# Altium project MB1389.PrjPcb (part 1 of 3)
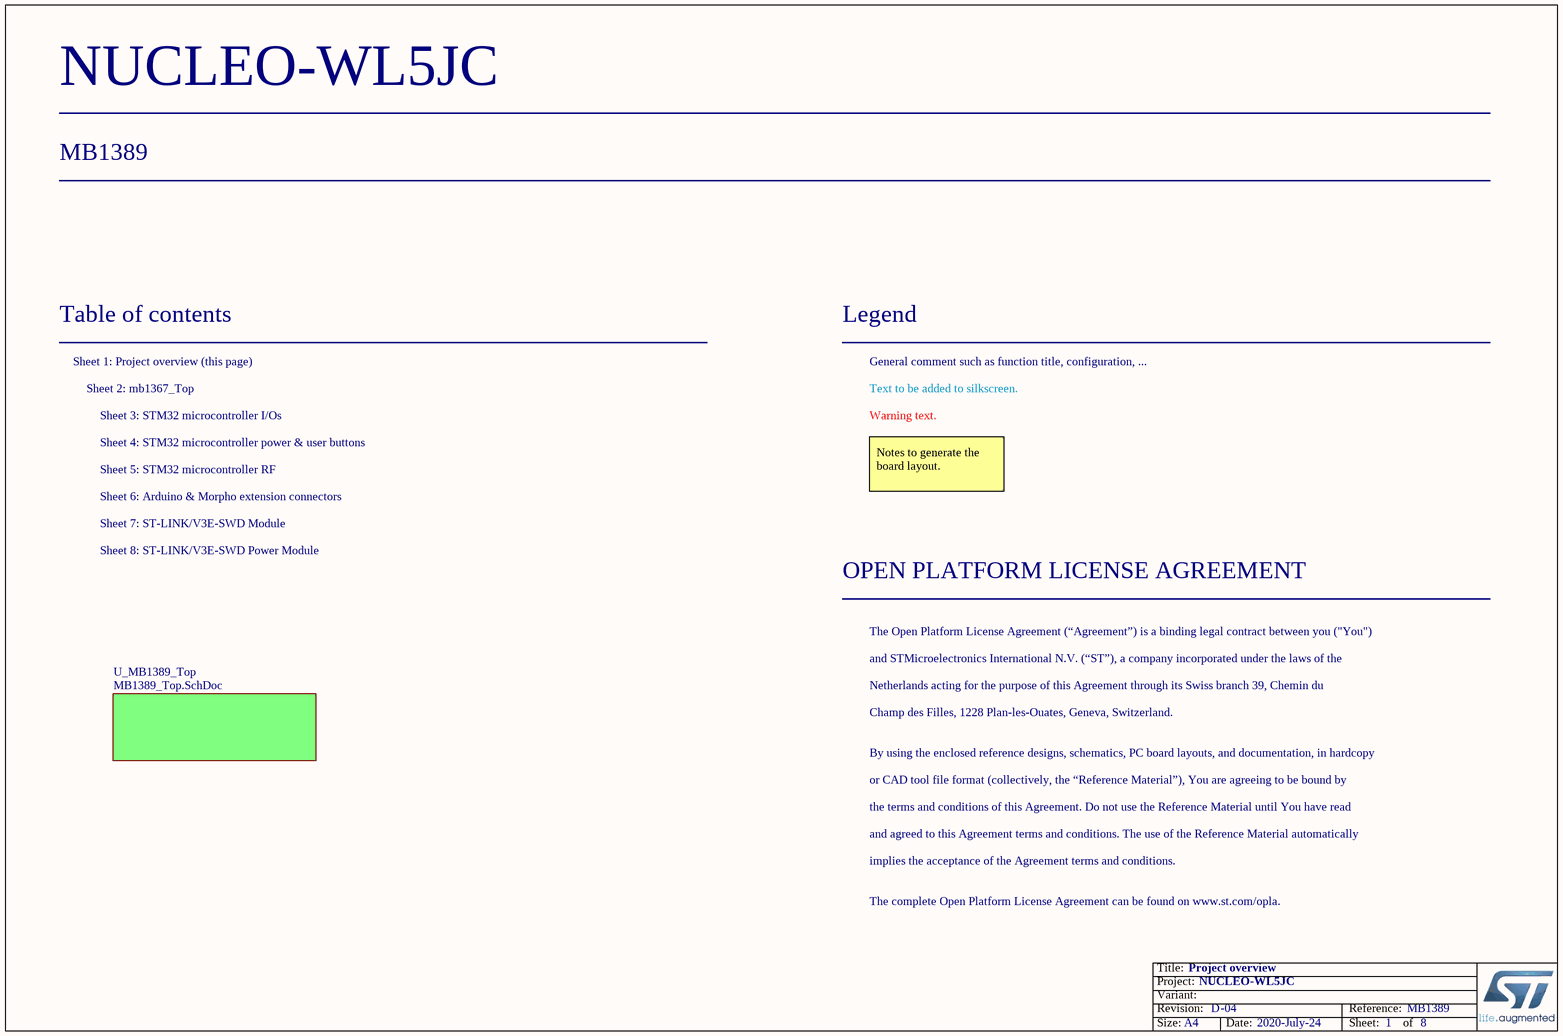
[diagram p0: Project_overview.SchDoc]
Board_Assembly_Revision: 04; Board_Document_Date: 2020-July-24; Board_Name: NUCLEO-WL5JC; Board_PCB_Revision: D; Board_Reference: MB1389
8 sheets, 259 parts. Net scope: flat (ports and power ports of the same name join across sheets).
Board file: MB1389.PcbDoc
Sheets:
  Project_overview.SchDoc
    U_MB1389_Top = MB1389_Top.SchDoc
      U_STM32_microcontroller_IOs = STM32_microcontroller_IOs.SchDoc
      U_STLink_V3E_Module = STLink_V3E_Module.SchDoc
      U_STLink_V3E_PWR = STLink_V3E_PWR.SchDoc
      U_Arduino_extension_connectors = Arduino_extension_connectors.SchDoc
      U_STM32_microcontroller_RF = STM32_microcontroller_RF.SchDoc
      U_STM32_microcontroller_power = STM32_microcontroller_power.SchDoc

## Sheet Project_overview.SchDoc: Project overview
size A4; Date: Not used; ApprovedBy: Not used; CheckedBy: Not used; Author: Not used; CompanyName: STMicroelectronics; DrawnBy: Not used; Engineer: Not used; Organization: Not used; Address1: Not used; Address2: Not used; Address3: Not used; Address4: Not used; DocumentNumber: 1; Revision: Not used; SheetNumber: 1; SheetTotal: 8; CurrentTime: Not used; CurrentDate: Not used; Time: Not used; DocumentFullPathAndName: Not used; DocumentName: Not used; ModifiedDate: Not used; ImagePath: Not used; ProjectName: Not used; Application_BuildNumber: Not used

### Sub-sheets
U_MB1389_Top = MB1389_Top.SchDoc: no entries

### Notes on the sheet
- Table of contents
- Sheet 1: Project overview (this page)
- Legend
- General comment such as function title, configuration, ...
- Sheet 2: mb1367_Top
- Sheet 4: STM32 microcontroller power & user buttons
- Sheet 3: STM32 microcontroller I/Os
- Text to be added to silkscreen.
- Warning text.
- Sheet 6: Arduino & Morpho extension connectors
- Sheet 5: STM32 microcontroller RF
- Notes to generate the board layout.
- Sheet 7: ST-LINK/V3E-SWD Module
- Sheet 8: ST-LINK/V3E-SWD Power Module
- OPEN PLATFORM LICENSE AGREEMENT
- The Open Platform License Agreement (“Agreement”) is a binding legal contract between you ("You")
- and STMicroelectronics International N.V. (“ST”), a company incorporated under the laws of the
- Netherlands acting for the purpose of this Agreement through its Swiss branch 39, Chemin du
- Champ des Filles, 1228 Plan-les-Ouates, Geneva, Switzerland.
- By using the enclosed reference designs, schematics, PC board layouts, and documentation, in hardcopy
- or CAD tool file format (collectively, the “Reference Material”), You are agreeing to be bound by
- the terms and conditions of this Agreement. Do not use the Reference Material until You have read
- and agreed to this Agreement terms and conditions. The use of the Reference Material automatically
- implies the acceptance of the Agreement terms and conditions.
- The complete Open Platform License Agreement can be found on www.st.com/opla.
- Title:
- Project:
- Size:
- Revision:
- Variant:
- A4
- -
- Date:
- Reference:
- Sheet:
- of

## Sheet MB1389_Top.SchDoc: Top hierarchical view
size A4; Date: Not used; ApprovedBy: Not used; CheckedBy: Not used; Author: Not used; CompanyName: STMicroelectronics; DrawnBy: Not used; Engineer: Not used; Organization: Not used; Address1: Not used; Address2: Not used; Address3: Not used; Address4: Not used; DocumentNumber: 2; Revision: Not used; SheetNumber: 2; SheetTotal: 8; CurrentTime: Not used; CurrentDate: Not used; Time: Not used; DocumentFullPathAndName: Not used; DocumentName: Not used; ModifiedDate: Not used; ImagePath: Not used; ProjectName: Not used; Application_BuildNumber: Not used
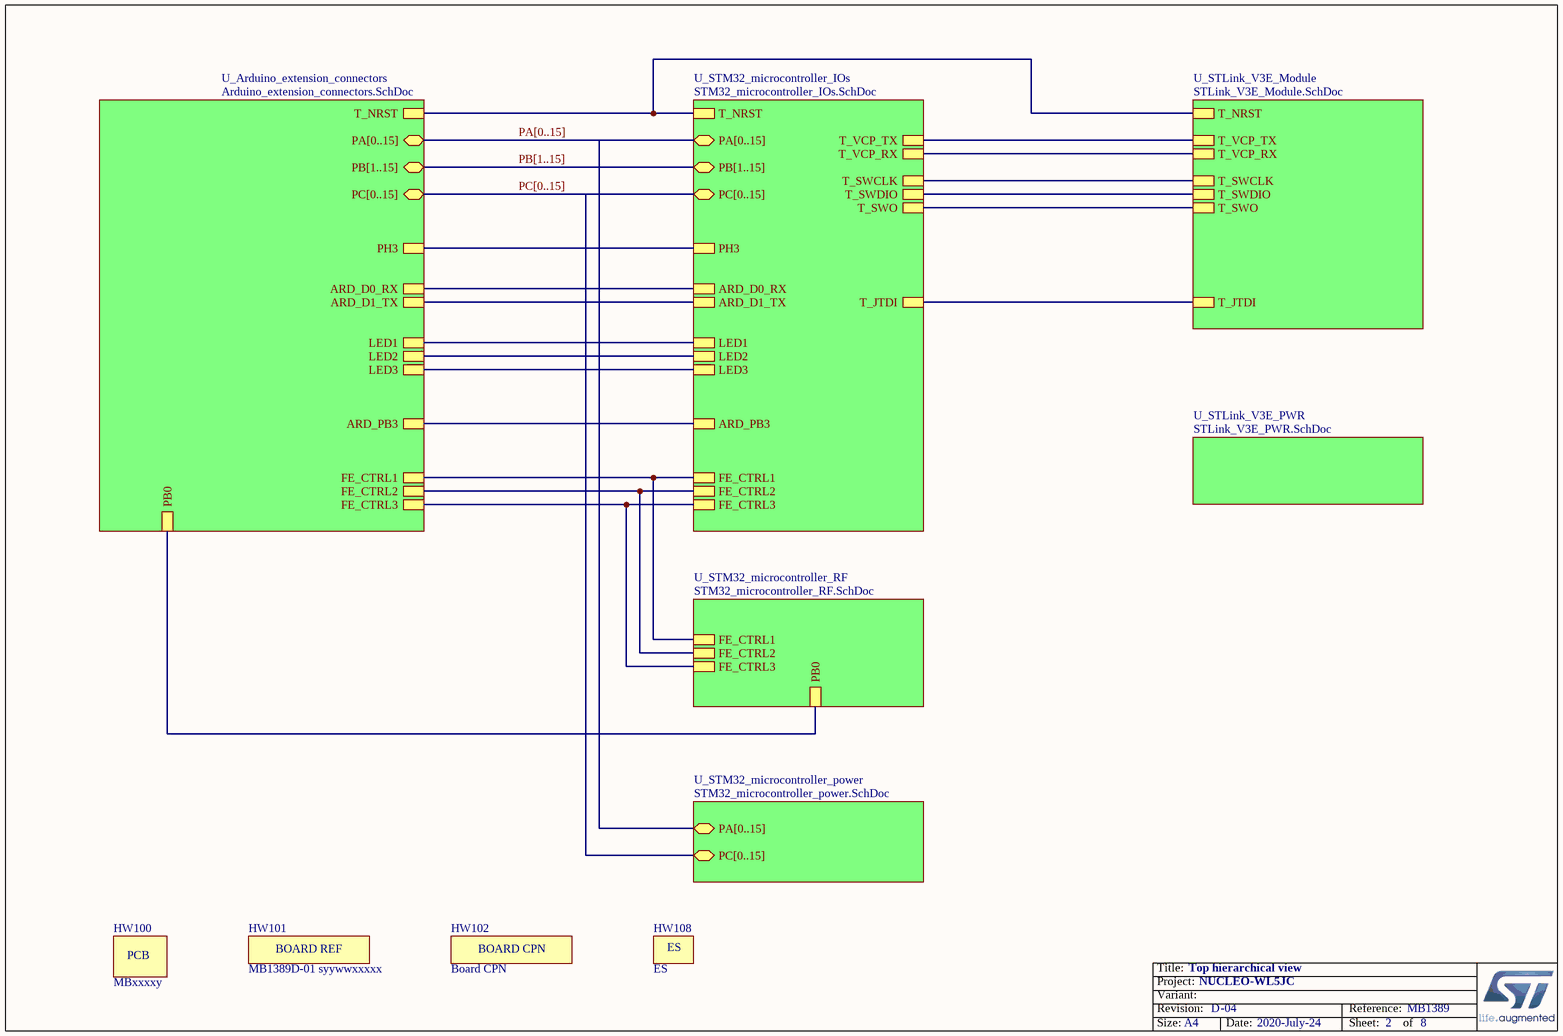
[diagram p1: MB1389_Top.SchDoc]

### Parts
HW100  value MBxxxxy  (mechanical)
HW101  value MB1389D-01 syywwxxxxx  [STICKER_BOARD-REF_25X5]  (mechanical)
HW102  value Board CPN  [STICKER_BOARD-CPN_25X5]  (mechanical)
HW108  value ES  (mechanical)

### Sub-sheets
U_Arduino_extension_connectors = Arduino_extension_connectors.SchDoc: PA[0..15] (bidir), PB[1..15] (bidir), PC[0..15] (bidir), T_NRST, ARD_D0_RX, ARD_D1_TX, LED1, LED2, LED3, FE_CTRL1, FE_CTRL2, PB0, PH3, FE_CTRL3, ARD_PB3
U_STLink_V3E_Module = STLink_V3E_Module.SchDoc: T_SWCLK, T_SWO, T_NRST, T_SWDIO, T_VCP_TX, T_VCP_RX, T_JTDI
U_STLink_V3E_PWR = STLink_V3E_PWR.SchDoc: no entries
U_STM32_microcontroller_IOs = STM32_microcontroller_IOs.SchDoc: T_NRST, PA[0..15] (bidir), PB[1..15] (bidir), PC[0..15] (bidir), ARD_D0_RX, ARD_D1_TX, T_VCP_TX, T_VCP_RX, T_SWCLK, T_SWO, T_SWDIO, T_JTDI, FE_CTRL2, FE_CTRL1, LED1, LED2, LED3, PH3, FE_CTRL3, ARD_PB3
U_STM32_microcontroller_power = STM32_microcontroller_power.SchDoc: PA[0..15] (bidir), PC[0..15] (bidir)
U_STM32_microcontroller_RF = STM32_microcontroller_RF.SchDoc: FE_CTRL2, FE_CTRL1, PB0, FE_CTRL3

### Nets
(unnamed): sheet U_STM32_microcontroller_IOs/T_NRST, sheet U_STLink_V3E_Module/T_NRST, sheet U_Arduino_extension_connectors/T_NRST
(unnamed): sheet U_STM32_microcontroller_IOs/ARD_D0_RX, sheet U_Arduino_extension_connectors/ARD_D0_RX
(unnamed): sheet U_STM32_microcontroller_IOs/ARD_D1_TX, sheet U_Arduino_extension_connectors/ARD_D1_TX
(unnamed): sheet U_STM32_microcontroller_IOs/T_VCP_TX, sheet U_STLink_V3E_Module/T_VCP_TX
(unnamed): sheet U_STM32_microcontroller_IOs/T_VCP_RX, sheet U_STLink_V3E_Module/T_VCP_RX
(unnamed): sheet U_STM32_microcontroller_IOs/T_SWCLK, sheet U_STLink_V3E_Module/T_SWCLK
(unnamed): sheet U_STM32_microcontroller_IOs/T_SWO, sheet U_STLink_V3E_Module/T_SWO
(unnamed): sheet U_STM32_microcontroller_IOs/T_SWDIO, sheet U_STLink_V3E_Module/T_SWDIO
(unnamed): sheet U_STM32_microcontroller_IOs/T_JTDI, sheet U_STLink_V3E_Module/T_JTDI
(unnamed): sheet U_STM32_microcontroller_IOs/FE_CTRL2, sheet U_Arduino_extension_connectors/FE_CTRL2, sheet U_STM32_microcontroller_RF/FE_CTRL2
(unnamed): sheet U_STM32_microcontroller_IOs/FE_CTRL1, sheet U_Arduino_extension_connectors/FE_CTRL1, sheet U_STM32_microcontroller_RF/FE_CTRL1
(unnamed): sheet U_STM32_microcontroller_IOs/LED1, sheet U_Arduino_extension_connectors/LED1
(unnamed): sheet U_STM32_microcontroller_IOs/LED2, sheet U_Arduino_extension_connectors/LED2
(unnamed): sheet U_STM32_microcontroller_IOs/LED3, sheet U_Arduino_extension_connectors/LED3
(unnamed): sheet U_STM32_microcontroller_IOs/PH3, sheet U_Arduino_extension_connectors/PH3
(unnamed): sheet U_STM32_microcontroller_IOs/FE_CTRL3, sheet U_Arduino_extension_connectors/FE_CTRL3, sheet U_STM32_microcontroller_RF/FE_CTRL3
(unnamed): sheet U_STM32_microcontroller_IOs/ARD_PB3, sheet U_Arduino_extension_connectors/ARD_PB3
(unnamed): sheet U_Arduino_extension_connectors/PB0, sheet U_STM32_microcontroller_RF/PB0

### Buses and harness runs
bus PA[0..15] = sheet U_Arduino_extension_connectors/PA[0..15] = sheet U_STM32_microcontroller_IOs/PA[0..15] = sheet U_STM32_microcontroller_power/PA[0..15]
bus PB[1..15] = sheet U_Arduino_extension_connectors/PB[1..15] = sheet U_STM32_microcontroller_IOs/PB[1..15]
bus PC[0..15] = sheet U_Arduino_extension_connectors/PC[0..15] = sheet U_STM32_microcontroller_IOs/PC[0..15] = sheet U_STM32_microcontroller_power/PC[0..15]

### Notes on the sheet
- Title:
- Project:
- Size:
- Revision:
- Variant:
- A4
- -
- Date:
- Reference:
- Sheet:
- of
- (in symbol MCD-00235) BOARD REF
- (in symbol MCD-00547) BOARD CPN

### Library data of the parts
HW100 = MCD-00216: PCB, xxxx for PCB number, Y for PCB revision; Part_Type: Mechanical; Provided_By: SUBCO; Internal_Part_Number: MCD-00216; Status: Released; Manufacturer_Part_Number: n/a; Manufacturer: n/a; ComponentLink1Description: Datasheet; ECCN_US: n/a; ECCN_EU: n/a
HW101 = MCD-00235: Board sticker to mention board reference + serial number + QR code; Part_Type: Mechanical; Provided_By: SUBCO; Initial_Board_Reference: MB1319; Internal_Part_Number: MCD-00235; Status: Released; Manufacturer_Part_Number: n/a; Manufacturer: n/a; ComponentLink1Description: Datasheet; ComponentLink1URL: n/a
HW102 = MCD-00547: Product sticker to mention product CPN + product FG; Part_Type: Mechanical; Provided_By: SUBCO; Initial_Board_Reference: MB1319; Remark: PCH W35 footprint requested to have a space on board for stickers.; Internal_Part_Number: MCD-00547; Status: Released; Manufacturer_Part_Number: n/a; Manufacturer: n/a; ComponentLink1Description: Datasheet; ComponentLink1URL: NA
HW108 = MCD-00234: Sticker to mention ES sample; Part_Type: Mechanical; Provided_By: SUBCO; Initial_Board_Reference: MB1319; Internal_Part_Number: MCD-00234; Status: Released; Manufacturer_Part_Number: n/a; Manufacturer: n/a; ComponentLink1Description: Datasheet

## Sheet STM32_microcontroller_IOs.SchDoc: STM32 microcontroller I/Os
size A4; Date: Not used; ApprovedBy: Not used; CheckedBy: Not used; Author: Not used; CompanyName: STMicroelectronics; DrawnBy: Not used; Engineer: Not used; Organization: Not used; Address1: Not used; Address2: Not used; Address3: Not used; Address4: Not used; DocumentNumber: 3; Revision: Not used; SheetNumber: 3; SheetTotal: 8; CurrentTime: Not used; CurrentDate: Not used; Time: Not used; DocumentFullPathAndName: Not used; DocumentName: Not used; ModifiedDate: Not used; ImagePath: Not used; ProjectName: Not used; Application_BuildNumber: Not used
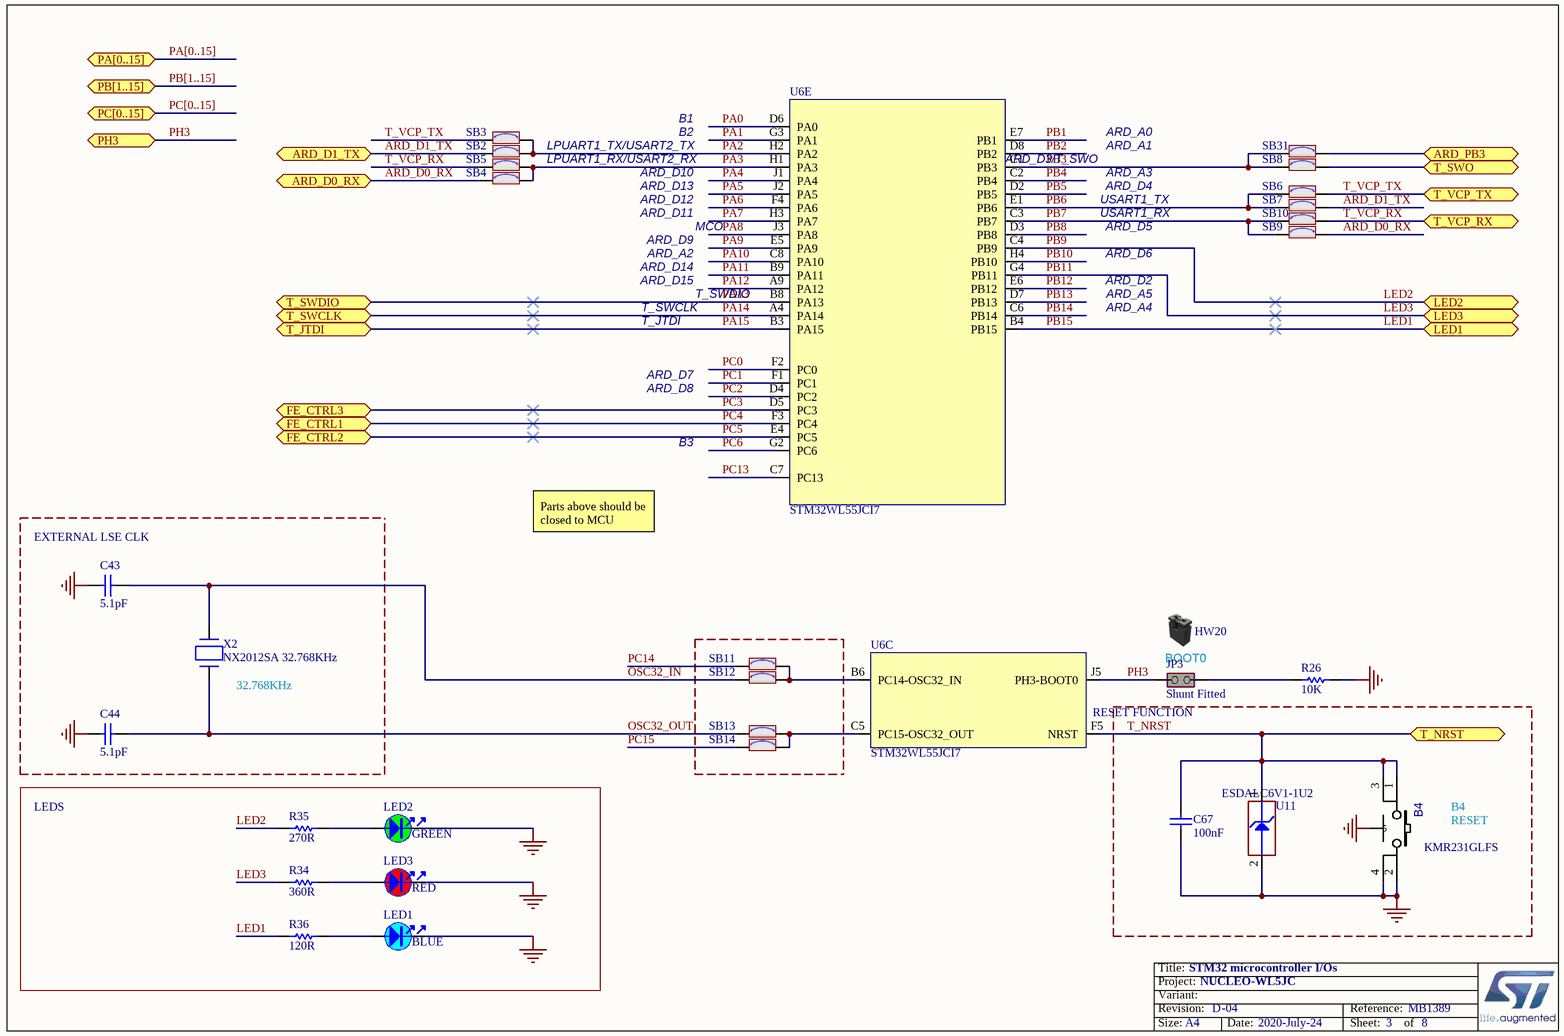
[diagram p2: STM32_microcontroller_IOs.SchDoc]

### Parts
B4  value KMR231GLFS  [SWI_C&K_Y78B23110FP__ITT_KMR231GLFS]
C43  value 5.1pF  [C0402]
C44  value 5.1pF  [C0402]
C67  value 100nF  [C0402]
HW20  (no value)  (mechanical)
JP3  value Shunt Fitted  [CON_SAMTEC_TSW-102-07-G-S]
LED1  value BLUE  [LED_0603_OSRAM_LB-Q39G-L2OO-35-1_BLUE_1A2K_H0P4]
LED2  value GREEN  [LED_0603_OSRAM_LG-Q396-PS-35_GREEN_1A2K_H0P4]
LED3  value RED  [LED_0603_VISHAY_VLMS1300-GS08_RED_1A2K_H0P8]
R26  value 10K  [R0603]
R34  value 360R  [R0402]
R35  value 270R  [R0402]
R36  value 120R  [R0402]
SB2  (no value)  [SOLDER-BRIDGE_R0603-0R]
SB3  (no value)  [SOLDER-BRIDGE_R0603-0R]
SB4  (no value)  [SOLDER-BRIDGE_R0603-0R]
SB5  (no value)  [SOLDER-BRIDGE_R0603-0R]
SB6  (no value)  [SOLDER-BRIDGE_R0603-0R]
SB7  (no value)  [SOLDER-BRIDGE_R0603-0R]
SB8  (no value)  [SOLDER-BRIDGE_R0603-0R]
SB9  (no value)  [SOLDER-BRIDGE_R0603-0R]
SB10  (no value)  [SOLDER-BRIDGE_R0603-0R]
SB11  (no value)  [SOLDER-BRIDGE_R0603-0R]
SB12  (no value)  [SOLDER-BRIDGE_R0603-0R]
SB13  (no value)  [SOLDER-BRIDGE_R0603-0R]
SB14  (no value)  [SOLDER-BRIDGE_R0603-0R]
SB31  (no value)  [SOLDER-BRIDGE_R0603-0R]
U6  value STM32WL55JCI7  [ICC_UFBGA73_5X5_P050]  (parts C,E of 5)
U11  value ESDALC6V1-1U2  [ESD_ST0201]
X2  value NX2012SA 32.768KHz  [CRY_NX2012SA_2P]

### Blocks framed on the sheet
LEDS: LED1-LED3 R34-R36

### Ports
ARD_D0_RX, ARD_D1_TX, ARD_PB3, FE_CTRL1, FE_CTRL2, FE_CTRL3, LED1, LED2, LED3, PA[0..15] (bidir), PB[1..15] (bidir), PC[0..15] (bidir), PH3, T_JTDI, T_NRST, T_SWCLK, T_SWDIO, T_SWO, T_VCP_RX, T_VCP_TX

### Nets
GND: B4.2 B4.4 B4.5 C43.2 C44.2 C67.1 LED1.2 LED2.2 LED3.2 R26.1 U11.2(GND)
ARD_D0_RX: SB4.2 SB9.1 ; port ARD_D0_RX
ARD_D1_TX: SB2.2 SB7.1 ; port ARD_D1_TX
ARD_PB3: SB31.2 ; port ARD_PB3
LED1: R36.1 U6.B4(PB15) ; port LED1  [also labelled PB15]
LED2: R35.1 U6.C4(PB9) ; port LED2  [also labelled PB9]
LED3: R34.1 U6.G4(PB11) ; port LED3  [also labelled PB11]
OSC32_IN: C43.1 SB12.1 X2.2(X2)
OSC32_OUT: C44.1 SB13.1 X2.1(X1)
PA0: U6.D6(PA0)
PA1: U6.G3(PA1)
PA2: SB2.1 SB3.2 U6.H2(PA2)
PA3: SB4.1 SB5.2 U6.H1(PA3)
PA4: U6.J1(PA4)
PA5: U6.J2(PA5)
PA6: U6.F4(PA6)
PA7: U6.H3(PA7)
PA8: U6.J3(PA8)
PA9: U6.E5(PA9)
PA10: U6.C8(PA10)
PA11: U6.B9(PA11)
PA12: U6.A9(PA12)
PA13: U6.B8(PA13) ; port T_SWDIO
PA14: U6.A4(PA14) ; port T_SWCLK
PA15: U6.B3(PA15) ; port T_JTDI
PB1: U6.E7(PB1)
PB2: U6.D8(PB2)
PB3: SB8.1 SB31.1 U6.C1(PB3)
PB4: U6.C2(PB4)
PB5: U6.D2(PB5)
PB6: SB6.1 SB7.2 U6.E1(PB6)
PB7: SB9.2 SB10.1 U6.C3(PB7)
PB8: U6.D3(PB8)
PB10: U6.H4(PB10)
PB12: U6.E6(PB12)
PB13: U6.D7(PB13)
PB14: U6.C6(PB14)
PC0: U6.F2(PC0)
PC1: U6.F1(PC1)
PC2: U6.D4(PC2)
PC3: U6.D5(PC3) ; port FE_CTRL3  [project net FE_CTRL3]
PC4: U6.F3(PC4) ; port FE_CTRL1  [project net FE_CTRL1]
PC5: U6.E4(PC5) ; port FE_CTRL2  [project net FE_CTRL2]
PC6: U6.G2(PC6)
PC13: U6.C7(PC13)
PC14: SB11.1
PC15: SB14.1
PH3: JP3.1(COMMON) U6.J5(PH3-BOOT0) ; port PH3
T_NRST: B4.1 B4.3 C67.2 U6.F5(NRST) U11.1(IO1) ; port T_NRST
T_SWO: SB8.2 ; port T_SWO
T_VCP_RX: SB5.1 SB10.2 ; port T_VCP_RX
T_VCP_TX: SB3.1 SB6.2 ; port T_VCP_TX
NetJP3_2: JP3.2(NO) R26.2
NetLED1_1: LED1.1 R36.2
NetLED2_1: LED2.1 R35.2
NetLED3_1: LED3.1 R34.2
NetSB11_2: SB11.2 SB12.2 U6.B6(PC14-OSC32_IN)
NetSB13_2: SB13.2 SB14.2 U6.C5(PC15-OSC32_OUT)

### Buses and harness runs
bus PA[0..15] = port PA[0..15]
bus PB[1..15] = port PB[1..15]
bus PC[0..15] = port PC[0..15]

### Notes on the sheet
- LPUART1_TX/USART2_TX
- LPUART1_RX/USART2_RX
- ARD_D10
- B2
- B1
- ARD_D3/T_SWO
- ARD_A0
- ARD_A1
- ARD_A3
- ARD_D13
- ARD_D12
- ARD_D11
- ARD_D9
- MCO
- USART1_RX
- USART1_TX
- ARD_D5
- ARD_D4
- T_SWCLK
- T_SWDIO
- ARD_D14
- ARD_D15
- ARD_A2
- ARD_D6
- ARD_A4
- ARD_A5
- ARD_D2
- T_JTDI
- ARD_D7
- ARD_D8
- B3
- (near C43) EXTERNAL LSE CLK
- Parts above should be closed to MCU
- (near X2) 32.768KHz
- RESET FUNCTION
- (near JP3) BOOT0
- RESET
- B4
- Title:
- Project:
- Size:
- Revision:
- Variant:
- A4
- -
- Date:
- Reference:
- Sheet:
- of

### Library data of the parts
B4 = MCD-01485: Microminiature Tact Switch for SMT - KMR 2 Series - 1.9 mm height; Part_Type: Misc; Manufacturer: C&K; Provided_By: SUBCO; Internal_Part_Number: MCD-01485; Status: Checked; Manufacturer_Part_Number: KMR231GLFS; ComponentLink1Description: Datasheet; ComponentLink1URL: http://tunmcdsvn.tun.st.com/Component_Datasheet_Library/Trunk/Misc/C&K_tactile_switch_KMR_series; ECCN_US: n/a; ECCN_EU: n/a
C43 C44 = MCD-00003: Capacitor, MLCC, 5.1pF, 50V, NPO, +-0.25pF, 0402, T=0.5mm; Manufacturer_Part_Number: CC0402CRNPO9BN5R1; Manufacturer: YAGEO; Provided_By: SUBCO; ECCN_US: EAR99; ECCN_EU: NEC; Internal_Part_Number: MCD-00003; Status: Released; Part_Type: Capacitor; Package: C0402; ComponentLink1Description: Datasheet; ComponentLink1URL: http://tunmcdsvn.tun.st.com/Component_Datasheet_Library/Trunk/Capacitors/Yageo_Capacitor_NP0_16V-to-50V
C67 = MCD-00102: Capacitor, MLCC, 100nF, 16V, X7R, 10%, 0402, T=0,5mm; Manufacturer_Part_Number: CC0402KRX7R7BB104; Manufacturer: YAGEO; Alternate_Manufacturer_Part_Number: GCM155R71C104KA55D; Alternate_Manufacturer: MURATA; Provided_By: SUBCO; ECCN_US: EAR99; ECCN_EU: NEC; Internal_Part_Number: MCD-00102; Status: Released; Package: C0402; ComponentLink1Description: Datasheet; Part_Type: Capacitor; ComponentLink1URL: http://tunmcdsvn.tun.st.com/Component_Datasheet_Library/Trunk/Capacitors/Yageo_Multilayer_Capacitor_X7R_series_100pF_to_22uF
HW20 = MCD-00043: SHUNT 2.54mm BLACK; Manufacturer_Part_Number: SNT-100-BK-G; Manufacturer: SAMTEC; Part_Type: Mechanical; Alternate_Manufacturer_Part_Number: 316102S111A; Alternate_Manufacturer: JIUBABA; Provided_By: SUBCO; Value: SNT-100-BK-G; Internal_Part_Number: MCD-00043; ComponentLink1Description: Datasheet; Status: Released; ComponentLink1URL: http://tunmcdsvn.tun.st.com/Component_Datasheet_Library/Trunk/Connectors/Samtec_Shunt_Jumper_SNT100; ECCN_US: n/a; ECCN_EU: n/a
JP3 = MCD-00683: Header, 2x1, 2,54mm, VR, TH, Height 5.84mm/2.54mm - Shunt Fitted by default; Part_Type: Connector; Manufacturer_Part_Number: TSW-102-07-x-S; Manufacturer: SAMTEC; Alternate_Manufacturer_Part_Number: 313102S111116; Alternate_Manufacturer: LIANYI; Provided_By: SUBCO; Internal_Part_Number: MCD-00683; Status: Released; ComponentLink1Description: Datasheet; ComponentLink1URL: http://tunmcdsvn.tun.st.com/Component_Datasheet_Library/Trunk/Connectors/Samtec_TSW-HTSW-series; ECCN_US: n/a; ECCN_EU: n/a
LED1 = MCD-00585: LED Blue, 0603 SMD, Forward Voltage Min=2,8V, Max=3,8V; Part_Type: Display; Manufacturer_Part_Number: LB Q39G-L2OO-35-1; Manufacturer: OSRAM OPTO SEMICONDUCTORS; Alternate_Manufacturer_Part_Number: 19-217-BHC-ZL1M2RY-3T-V4; Alternate_Manufacturer: EVERLIGHT; Order_Code_RS: 9148643; Provided_By: SUBCO; Internal_Part_Number: MCD-00585; Status: Released; Package: LED 0603; ComponentLink1Description: Datasheet; ComponentLink1URL: http://tunmcdsvn.tun.st.com/Component_Datasheet_Library/Trunk/Display/OSRAM_LED_BLUE_LB Q39G-L2OO-35-1; Order_Code_Digikey: 475-2816-1-ND; ECCN_US: n/a; ECCN_EU: n/a
LED2 = MCD-00588: LED Green, 0603 SMD, Forward Voltage Typ=2V, Max=2.5V; Part_Type: Display; Manufacturer_Part_Number: LG Q396-PS-35; Manufacturer: OSRAM OPTO SEMICONDUCTORS; Alternate_Manufacturer_Part_Number: VLMTG1300-GS08; Alternate_Manufacturer: VISHAY SEMICONDUCTOR OPTO DIVISION; Provided_By: SUBCO; Internal_Part_Number: MCD-00588; Status: Released; Package: LED 0603; ComponentLink1Description: Datasheet; ComponentLink1URL: http://tunmcdsvn.tun.st.com/Component_Datasheet_Library/Trunk/Display/OSRAM_LED_GREEN_LG Q396-PS-35; Order_Code_Digikey: LG Q396-PS-35-ND; ECCN_US: n/a; ECCN_EU: n/a
LED3 = MCD-00587: LED Red, 0603 SMD, 2V Forward Voltage; Part_Type: Display; Manufacturer_Part_Number: VLMS1300-GS08; Manufacturer: VISHAY; Alternate_Manufacturer_Part_Number: LS Q976-NR-1; Alternate_Manufacturer: OSRAM OPTO SEMICONDUCTORS; Provided_By: SUBCO; Internal_Part_Number: MCD-00587; Status: Released; Package: LED 0603; ComponentLink1Description: Datasheet; ComponentLink1URL: http://tunmcdsvn.tun.st.com/Component_Datasheet_Library/Trunk/Display/VISHAY_LED_RED_VLMS1300-GS08; Order_Code_Digikey: VLMS1300-GS08CT-ND; Order_Code_Farnell: 2078728; ECCN_US: n/a; ECCN_EU: n/a
R26 = MCD-00220: Resistor,10K,0603,1%,1/10W; Manufacturer_Part_Number: RC0603FR-0710KL; Manufacturer: YAGEO; Provided_By: SUBCO; ECCN_US: EAR99; ECCN_EU: NEC; Internal_Part_Number: MCD-00220; ComponentLink1Description: Datasheet; Status: Released; Part_Type: Resistor; Package: R0603; ComponentLink1URL: http://tunmcdsvn.tun.st.com/Component_Datasheet_Library/Trunk/Resistors/Yageo_Resistor_RC0603-series
R34 = MCD-00461: Resistor,360R,0402,1%,1/16W; Manufacturer_Part_Number: RC0402FR-07360RL; Manufacturer: YAGEO; Provided_By: SUBCO; ECCN_US: EAR99; ECCN_EU: NEC; Internal_Part_Number: MCD-00461; Status: Released; Part_Type: Resistor; Package: R0402; ComponentLink1Description: Datasheet; ComponentLink1URL: http://tunmcdsvn.tun.st.com/Component_Datasheet_Library/Trunk/Resistors/Yageo_Resistor_RC0402-series
R35 = MCD-00441: Resistor,270R,0402,1%,1/16W; Manufacturer_Part_Number: RC0402FR-07270RL; Manufacturer: YAGEO; Provided_By: SUBCO; ECCN_US: EAR99; ECCN_EU: NEC; Internal_Part_Number: MCD-00441; Status: Released; Part_Type: Resistor; Package: R0402; ComponentLink1Description: Datasheet; ComponentLink1URL: http://tunmcdsvn.tun.st.com/Component_Datasheet_Library/Trunk/Resistors/Yageo_Resistor_RC0402-series
R36 = MCD-00194: Resistor,120R,0402,1%,1/16W; Manufacturer_Part_Number: RC0402FR-07120RL; Manufacturer: YAGEO; Provided_By: SUBCO; ECCN_US: EAR99; ECCN_EU: NEC; Internal_Part_Number: MCD-00194; Status: Released; Part_Type: Resistor; Package: R0402; ComponentLink1Description: Datasheet; ComponentLink1URL: http://tunmcdsvn.tun.st.com/Component_Datasheet_Library/Trunk/Resistors/Yageo_Resistor_RC0402-series
SB2-SB14 SB31 = MCD-00071: Solder Bridge ON; Part_Type: Mechanical; Manufacturer_Part_Number: RC0603JR-070RL; Manufacturer: YAGEO; Provided_By: SUBCO; Internal_Part_Number: MCD-00071; Status: Released; Package: SB0603; ComponentLink1Description: Datasheet; ComponentLink1URL: http://tunmcdsvn.tun.st.com/Component_Datasheet_Library/Trunk/Resistors/Yageo_Resistor_RC0603-series; ECCN_US: n/a; ECCN_EU: n/a
U6 = MCD-01435: Multiprotocol Wireless 32-bit MCUwith LPWAN Sub-GHz radio solution; Part_Type: IC; Manufacturer: STMICROELECTRONICS; ECCN_US: tbd; Internal_Part_Number: MCD-01435; Status: Footprint available; Manufacturer_Part_Number: STM32WL55JCI7; Package: UFBGA73; ComponentLink1Description: Datasheet; ComponentLink1URL: http://tunmcdsvn.tun.st.com/Component_Datasheet_Library/Trunk/IC/STM_STM32WL5x; Provided_By: n/a; ECCN_EU: tbd
U11 = MCD-00170: ESD protection 6V1; Part_Type: Diode; Manufacturer: STMICROELECTRONICS; BMS_Part_Number: 9151132; Provided_By: SUBCO with ST control; ECCN_US: EAR99; ECCN_EU: NEC; Internal_Part_Number: MCD-00170; Status: Released; Manufacturer_Part_Number: ESDALC6V1-1U2; ComponentLink1Description: Datasheet; ComponentLink1URL: http://tunmcdsvn.tun.st.com/Component_Datasheet_Library/Trunk/Diodes/STM_ESD_ESDALC6V1-1U2
X2 = MCD-01479: Crystal 32.768kHz, 6pF, -+20ppm, 80Kohm max, SMD; Part_Type: Crystal_Osc; Manufacturer_Part_Number: NX2012SA 32.768KHz EXS00A-MU00527; Manufacturer: NDK; BMS_Part_Number: 9157049; Provided_By: SUBCO; ECCN_US: EAR99; ECCN_EU: NEC; Internal_Part_Number: MCD-01479; Status: Checked; Package: NX2012SA; ComponentLink1Description: Datasheet; ComponentLink1URL: http://tunmcdsvn.tun.st.com/Component_Datasheet_Library/Trunk/Crystal_Osc/NDK_NX2012SA 32.768KHz EXS00A-MU00527; Order_Code_Digikey: 644-1352

## Sheet STLink_V3E_Module.SchDoc: ST-LINK/V3E-SWD Module
size A4; Date: Not used; ApprovedBy: Not used; CheckedBy: Not used; Author: Alphonse BRUNO; CompanyName: STMicroelectronics; DrawnBy: Not used; Engineer: Not used; Organization: Not used; Address1: Not used; Address2: Not used; Address3: Not used; Address4: Not used; DocumentNumber: Not used; Revision: Not used; SheetNumber: 7; SheetTotal: 8; CurrentTime: Not used; CurrentDate: Not used; Time: Not used; DocumentFullPathAndName: Not used; DocumentName: Not used; ModifiedDate: Not used; ImagePath: Not used; ProjectName: Not used; Application_BuildNumber: Not used
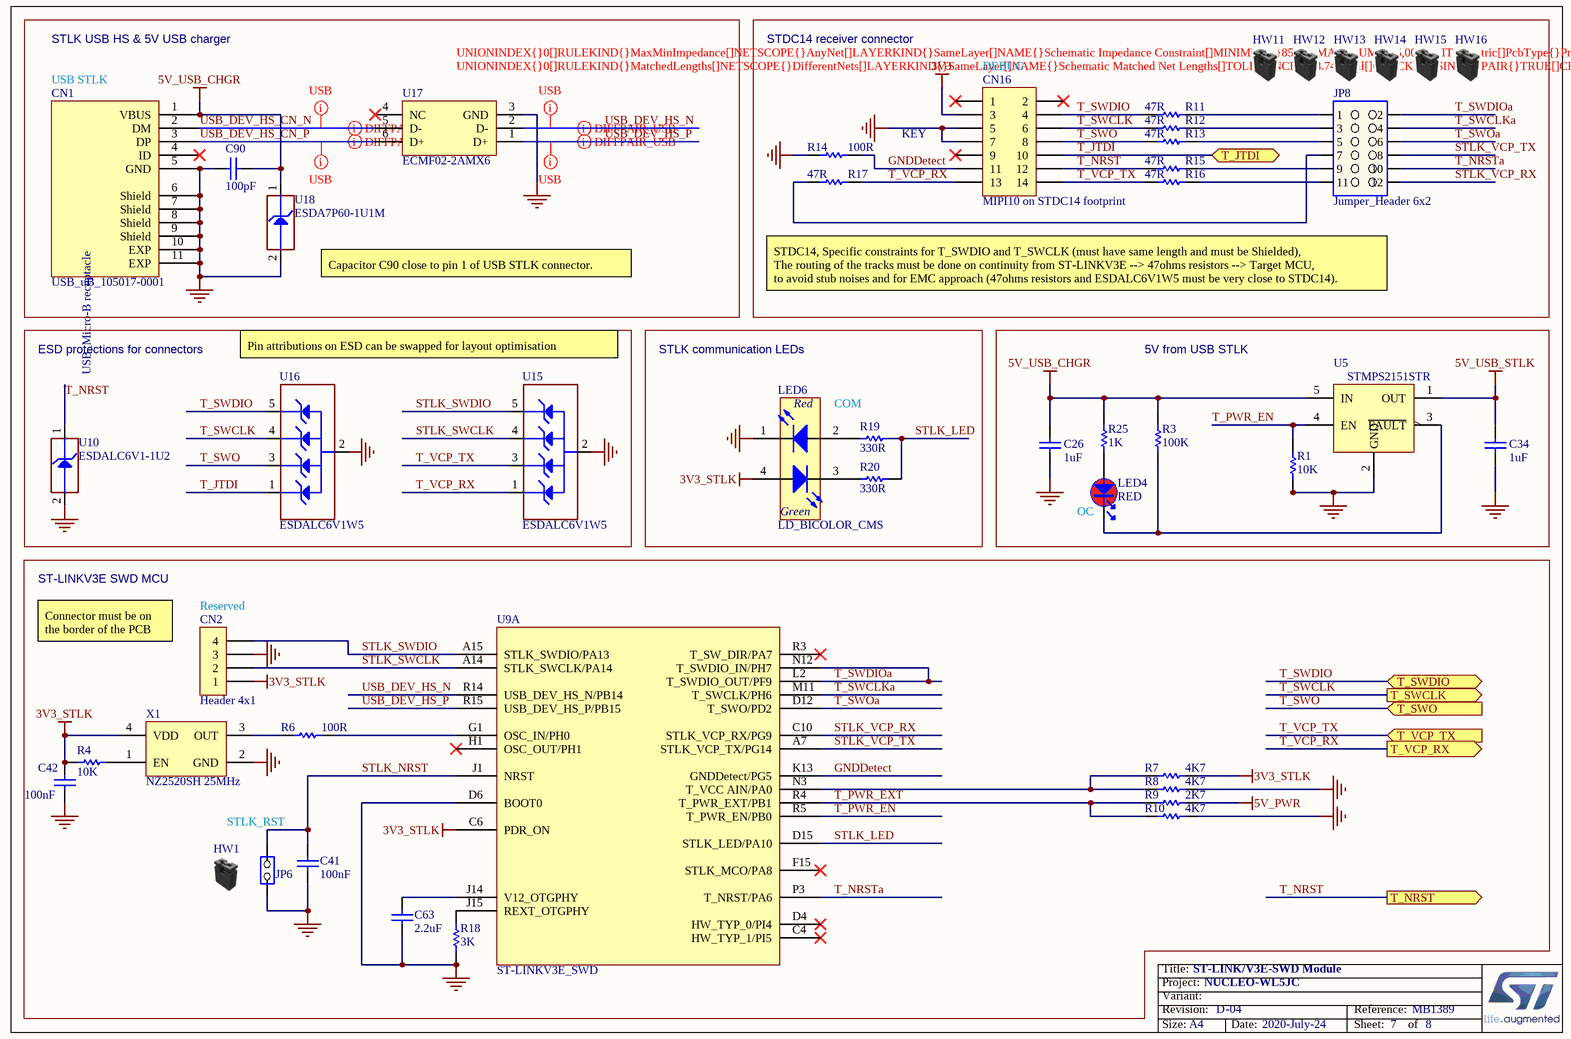
[diagram p3: STLink_V3E_Module.SchDoc]

### Parts
C26  value 1uF  [C0603]
C34  value 1uF  [C0603]
C41  value 100nF  [C0402]
C42  value 100nF  [C0402]
C63  value 2.2uF  [C0603]
C90  value 100pF  [C0402]
CN1  value USB_uB_105017-0001  [CON_USBMICROB_MOLEX_105017-0001_H2P90]
CN2  value Header 4x1  [CON_SAMTEC_TSW-104-07-G-S]
CN16  value MIPI10 on STDC14 footprint  [CON_STDC14_Receiver_MEDIUM_WITH_MIPI10_3D]
HW1  (no value)  (mechanical)
HW11  (no value)  (mechanical)
HW12  (no value)  (mechanical)
HW13  (no value)  (mechanical)
HW14  (no value)  (mechanical)
HW15  (no value)  (mechanical)
HW16  (no value)  (mechanical)
JP6  (no value)  [CON_SAMTEC_TSW-102-07-G-S]
JP8  value Jumper_Header 6x2  [CON_SAMTEC_TSW-106-07-X-D]
LED4  value RED  [LED_0603_VISHAY_VLMS1300-GS08_RED_1A2K_H0P8]
LED6  value LD_BICOLOR_CMS  [LED_BI-GR_HSMF-A201-A00J1]
R1  value 10K  [R0402]
R3  value 100K  [R0402]
R4  value 10K  [R0402]
R6  value 100R  [R0402]
R7  value 4K7  [R0402]
R8  value 4K7  [R0402]
R9  value 2K7  [R0402]
R10  value 4K7  [R0402]
R11  value 47R  [R0402]
R12  value 47R  [R0402]
R13  value 47R  [R0402]
R14  value 100R  [R0402]
R15  value 47R  [R0402]
R16  value 47R  [R0402]
R17  value 47R  [R0402]
R18  value 3K  [R0402]
R19  value 330R  [R0603]
R20  value 330R  [R0603]
R25  value 1K  [R0603]
U5  value STMPS2151STR  [MOS_SOT23-5L]
U9  value ST-LINKV3E_SWD  [ICC_UFBGA201_176+25_10X10_P065]  (part A of 2)
U10  value ESDALC6V1-1U2  [ESD_ST0201]
U15  value ESDALC6V1W5  [ESD_SOT323-5L]
U16  value ESDALC6V1W5  [ESD_SOT323-5L]
U17  value ECMF02-2AMX6  [ESD_QFN-6L_1P7X1P5_P050]
U18  value ESDA7P60-1U1M  [ESD_QFN2_1P6X1_P125]
X1  value NZ2520SH 25MHz  [OSC_NDK_NZ2520SB_4P]

### Blocks framed on the sheet
ESD protections for connectors: U10 U15 U16

### Ports
T_JTDI, T_NRST, T_SWCLK, T_SWDIO, T_SWO, T_VCP_RX, T_VCP_TX

### Nets
3V3: CN16.3
3V3_STLK: C42.2 CN2.1 LED6.4(YellowGreen_anode) R4.1 R7.1 U9.C6(PDR_ON) X1.4(VDD)
5V_PWR: R9.1
5V_USB_CHGR: C26.2 C90.2 CN1.1(VBUS) R3.2 R25.2 U5.5(IN) U18.1(IO1)
5V_USB_STLK: C34.2 U5.1(OUT)
GND: C26.1 C34.1 C41.1 C42.1 C63.1 C90.1 CN1.5(GND) CN1.6(Shield) CN1.7(Shield) CN1.8(Shield) CN1.9(Shield) CN1.10(EXP) CN1.11(EXP) CN2.3 CN16.5 CN16.7 JP6.1(COMMON) LED6.1(RED_cathode) R1.1 R8.1 R10.1 R14.1 R18.1 U5.2(GND) U9.D6(BOOT0) U10.2(GND) U15.2(GND) U16.2(GND) U17.3(GND) U18.2(GND) X1.2(GND)
GNDDetect: CN16.11 R14.2 U9.K13(GNDDetect/PG5)
STLK_LED: R19.2 R20.2 U9.D15(STLK_LED/PA10)
STLK_NRST: C41.2 JP6.2(NO) U9.J1(NRST)
STLK_SWCLK: CN2.2 U9.A14(STLK_SWCLK/PA14) U15.4(IO3)
STLK_SWDIO: CN2.4 U9.A15(STLK_SWDIO/PA13) U15.5(IO4)
STLK_VCP_RX: JP8.12 U9.C10(STLK_VCP_RX/PG9)
STLK_VCP_TX: JP8.8 U9.A7(STLK_VCP_TX/PG14)
T_JTDI: CN16.10 U16.1(IO1) ; port T_JTDI  [project net PA15]
T_NRST: CN16.12 R15.1 U10.1(IO1) ; port T_NRST
T_NRSTa: JP8.10 U9.P3(T_NRST/PA6)
T_PWR_EN: R1.2 U5.4(EN) U9.R5(T_PWR_EN/PB0)
T_PWR_EXT: R9.2 R10.2 U9.R4(T_PWR_EXT/PB1)
T_SWCLK: CN16.6 R12.1 U16.4(IO3) ; port T_SWCLK  [project net PA14]
T_SWCLKa: JP8.4 U9.M11(T_SWCLK/PH6)
T_SWDIO: CN16.4 R11.1 U16.5(IO4) ; port T_SWDIO  [project net PA13]
T_SWDIOa: JP8.2 U9.L2(T_SWDIO_OUT/PF9) U9.N12(T_SWDIO_IN/PH7)
T_SWO: CN16.8 R13.1 U16.3(IO2) ; port T_SWO
T_SWOa: JP8.6 U9.D12(T_SWO/PD2)
T_VCP_RX: CN16.13 R17.2 U15.1(IO1) ; port T_VCP_RX
T_VCP_TX: CN16.14 R16.1 U15.3(IO2) ; port T_VCP_TX
USB_DEV_HS_CN_N: CN1.2(DM) U17.5(D-)
USB_DEV_HS_CN_P: CN1.3(DP) U17.6(D+)
USB_DEV_HS_N: U9.R14(USB_DEV_HS_N/PB14) U17.2(D-)
USB_DEV_HS_P: U9.R15(USB_DEV_HS_P/PB15) U17.1(D+)
NetC63_2: C63.2 U9.J14(V12_OTGPHY)
NetJP8_1: JP8.1 R11.2
NetJP8_3: JP8.3 R12.2
NetJP8_5: JP8.5 R13.2
NetJP8_7: JP8.7 R17.1
NetJP8_9: JP8.9 R15.2
NetJP8_11: JP8.11 R16.2
NetLED4_1: LED4.1 R25.1
NetLED4_2: LED4.2 R3.1 U5.3(~{FAULT})
NetLED6_2: LED6.2(Red_anode) R19.1
NetLED6_3: LED6.3(YellowGreen_cathode) R20.1
NetR4_2: R4.2 X1.1(EN)
NetR6_1: R6.1 X1.3(OUT)
NetR6_2: R6.2 U9.G1(OSC_IN/PH0)
NetR7_2: R7.2 R8.2 U9.N3(T_VCC_AIN/PA0)
NetR18_2: R18.2 U9.J15(REXT_OTGPHY)

Not connected (* = marked no-connect by the designer): CN1 4(ID)*; CN16 1* 2* 9*; U9 C4(HW_TYP_1/PI5)* D4(HW_TYP_0/PI4)* F15(STLK_MCO/PA8)* H1(OSC_OUT/PH1)* R3(T_SW_DIR/PA7)*; U17 4(NC)*

### Layout directives
differential pair; rule Impedance Constraint [Min = 85.00    Max = 95.00    ]: USB_DEV_HS_CN_N, USB_DEV_HS_CN_P, USB_DEV_HS_N, USB_DEV_HS_P
rule Undefined; rule Matched Net Lengths [Tolerance = 2mm]; rule Impedance Constraint [Min = 85.00    Max = 95.00    ]: USB_DEV_HS_CN_N, USB_DEV_HS_CN_P, USB_DEV_HS_N, USB_DEV_HS_P

### Notes on the sheet
- STLK USB HS & 5V USB charger
- STDC14 receiver connector
- USB STLK
- (near CN16) DEBUG
- KEY
- (near U18) Capacitor C90 close to pin 1 of USB STLK connector.
- STDC14, Specific constraints for T_SWDIO and T_SWCLK (must have same length and must be Shielded),
  The routing of the tracks must be done on continuity from ST-LINKV3E --> 47ohms resistors --> Target MCU,
  to avoid stub noises and for EMC approach (47ohms resistors and ESDALC6V1W5 must be very close to STDC14).
- Pin attributions on ESD can be swapped for layout optimisation
- STLK communication LEDs
- 5V from USB STLK
- COM
- (near LED4) OC
- ST-LINKV3E SWD MCU
- Connector must be on the border of the PCB
- (near CN2) Reserved
- STLK_RST
- Title:
- Project:
- Size:
- Revision:
- Variant:
- A4
- -
- Date:
- Reference:
- Sheet:
- of
- (in symbol MCD-00028) USB_Micro-B receptacle
- (in symbol MCD-00051) Red; Green

### Library data of the parts
C26 C34 = MCD-00010: Capacitor, MLCC, 1uF, 16V, X5R, 10%, 0603, T=0,8mm; Manufacturer_Part_Number: CC0603KRX5R7BB105; Manufacturer: YAGEO; Provided_By: SUBCO; ECCN_US: EAR99; ECCN_EU: NEC; Internal_Part_Number: MCD-00010; Status: Released; Package: C0603; ComponentLink1Description: Datasheet; Part_Type: Capacitor; ComponentLink1URL: http://tunmcdsvn.tun.st.com/Component_Datasheet_Library/Trunk/Capacitors/Yageo_Multilayer_capacitor_X5R_series_100pF_to_100uF
C41 C42 = MCD-00102: as C67 on sheet STM32_microcontroller_IOs; Internal_Part_Number: MCD-00102; Status: Released; Package: C0402; ComponentLink1Description: Datasheet; Part_Type: Capacitor; ComponentLink1URL: http://tunmcdsvn.tun.st.com/Component_Datasheet_Library/Trunk/Capacitors/Yageo_Multilayer_Capacitor_X7R_series_100pF_to_22uF
C63 = MCD-00012: Capacitor, MLCC, 2.2uF, 10V, X5R, 10%, 0603, T=0,8mm; Manufacturer_Part_Number: CC0603KRX5R6BB225; Manufacturer: YAGEO; Alternate_Manufacturer_Part_Number: C0603C225K8PACTU; Alternate_Manufacturer: KEMET; BMS_Part_Number: 9142010; Provided_By: SUBCO; ECCN_US: EAR99; ECCN_EU: NEC; Internal_Part_Number: MCD-00012; Status: Released; Package: C0603; ComponentLink1Description: Datasheet; Part_Type: Capacitor; ComponentLink1URL: http://tunmcdsvn.tun.st.com/Component_Datasheet_Library/Trunk/Capacitors/Yageo_Multilayer_capacitor_X5R_series_100pF_to_100uF
C90 = MCD-00205: Capacitor, MLCC, 100pF, 50V, NPO, 5%, 0402, T=0,5mm; Manufacturer_Part_Number: CC0402JRNPO9BN101; Manufacturer: YAGEO; Provided_By: SUBCO; ECCN_US: EAR99; ECCN_EU: NEC; Internal_Part_Number: MCD-00205; Status: Released; Part_Type: Capacitor; Package: C0402; ComponentLink1Description: Datasheet; ComponentLink1URL: http://tunmcdsvn.tun.st.com/Component_Datasheet_Library/Trunk/Capacitors/Yageo_Capacitor_NP0_16V-to-50V
CN1 = MCD-00028: USB-MICRO-B, 0.65mm, RA, SMT, Bottom Mount,; Manufacturer_Part_Number: 1050170001; Manufacturer: MOLEX; Part_Type: Connector; Provided_By: SUBCO; Internal_Part_Number: MCD-00028; Status: Released; ComponentLink1Description: Datasheet; ComponentLink1URL: http://tunmcdsvn.tun.st.com/Component_Datasheet_Library/Trunk/Connectors/Molex_Connector-USB-microB_105017-0001; ECCN_US: n/a; ECCN_EU: n/a
CN2 = MCD-00029: Header, 4x1, 2,54mm, VR, TH, Height 5.84mm/2.54mm; Part_Type: Connector; Manufacturer_Part_Number: TSW-104-07-x-S; Manufacturer: SAMTEC; Provided_By: SUBCO; Internal_Part_Number: MCD-00029; Status: Released; ComponentLink1Description: Datasheet; ComponentLink1URL: http://tunmcdsvn.tun.st.com/Component_Datasheet_Library/Trunk/Connectors/Samtec_TSW-HTSW-series; ECCN_US: n/a; ECCN_EU: n/a
CN16 = MCD-01226: Header 5x2, 1.27mm, Dual row, Straight, Surface mount, vertical male connector. 3.05mm lead. Mates with FFSD connector. Footprint compatible with FTSH-107-01-L-DV,-K,-A,-P,-ES (STDC14 MEDIUM); Manufacturer_Part_Number: FTSH-105-01-L-DV-K; Manufacturer: SAMTEC; Alternate_Manufacturer_Part_Number: P127B-2x05MGF-079-0A; Alternate_Manufacturer: JIUBABA; Provided_By: SUBCO; Internal_Part_Number: MCD-01226; Status: Released; Part_Type: Connector; ComponentLink1Description: Datasheet; ComponentLink1URL: http://tunmcdsvn.tun.st.com/Component_Datasheet_Library/Trunk/Connectors/Samtec_FTSH_smt_series; ECCN_US: n/a; ECCN_EU: n/a
HW1 = MCD-00043: as HW20 on sheet STM32_microcontroller_IOs; Internal_Part_Number: MCD-00043; ComponentLink1Description: Datasheet; Status: Released; ComponentLink1URL: http://tunmcdsvn.tun.st.com/Component_Datasheet_Library/Trunk/Connectors/Samtec_Shunt_Jumper_SNT100; ECCN_US: n/a; ECCN_EU: n/a
HW11-HW16 = MCD-00043: SHUNT 2.54mm BLACK; Part_Type: Mechanical; Manufacturer: SAMTEC; Alternate_Manufacturer_Part_Number: 316102S111A; Alternate_Manufacturer: JIUBABA; Value: SNT-100-BK-G; Provided_By: SUBCO; Internal_Part_Number: MCD-00043; Status: Released; Manufacturer_Part_Number: SNT-100-BK-G; ComponentLink1Description: Datasheet; ComponentLink1URL: http://tunmcdsvn.tun.st.com/Component_Datasheet_Library/Trunk/Connectors/Samtec_Shunt_Jumper_SNT100; ECCN_US: n/a; ECCN_EU: n/a
JP6 = MCD-00045: Header, 2x1, 2,54mm, VR, TH, Height 5.84mm/2.54mm; Manufacturer_Part_Number: TSW-102-07-G-S; Manufacturer: SAMTEC; Part_Type: Connector; Alternate_Manufacturer_Part_Number: 313102S111116;313102S111116; Alternate_Manufacturer: JIUBABA; LIANYI; Value: Shunt not fitted; Provided_By: SUBCO; Internal_Part_Number: MCD-00045; Status: Released; ComponentLink1Description: Datasheet; ComponentLink1URL: http://tunmcdsvn.tun.st.com/Component_Datasheet_Library/Trunk/Connectors/Samtec_TSW-HTSW-series; ECCN_US: n/a; ECCN_EU: n/a
JP8 = MCD-00692: Header, 6x2, 2,54mm, VR, TH, Height 5.84mm/2.54mm; Part_Type: Connector; Manufacturer_Part_Number: TSW-106-07-x-D; Manufacturer: SAMTEC; Provided_By: SUBCO; Internal_Part_Number: MCD-00692; Status: Checked; ComponentLink1Description: Datasheet; ComponentLink1URL: http://tunmcdsvn.tun.st.com/Component_Datasheet_Library/Trunk/Connectors/Samtec_TSW-HTSW-series; ECCN_US: n/a; ECCN_EU: n/a
LED4 = MCD-00587: as LED3 on sheet STM32_microcontroller_IOs; Internal_Part_Number: MCD-00587; Status: Released; Package: LED 0603; ComponentLink1Description: Datasheet; ComponentLink1URL: http://tunmcdsvn.tun.st.com/Component_Datasheet_Library/Trunk/Display/VISHAY_LED_RED_VLMS1300-GS08; Order_Code_Digikey: VLMS1300-GS08CT-ND; Order_Code_Farnell: 2078728; ECCN_US: n/a; ECCN_EU: n/a
LED6 = MCD-00051: LED Bicolor; Part_Type: Display; Manufacturer_Part_Number: HSMF-A201-A00J1; Manufacturer: AVAGO TECHNOLOGIES; Alternate_Manufacturer_Part_Number: LE-RGW35280; Alternate_Manufacturer: EVERLUCK; Provided_By: SUBCO; ECCN_US: EAR99; ECCN_EU: NEC; Internal_Part_Number: MCD-00051; Status: Released; ComponentLink1Description: Datasheet; ComponentLink1URL: http://tunmcdsvn.tun.st.com/Component_Datasheet_Library/Trunk/Display/Avago_LED-SMC_HSMx-A2xx-02Feb2012
R1 R4 = MCD-00053: Resistor,10K,0402,1%,1/16W; Manufacturer_Part_Number: RC0402FR-0710KL; Manufacturer: YAGEO; BMS_Part_Number: 9131590; Provided_By: SUBCO; ECCN_US: EAR99; ECCN_EU: NEC; Internal_Part_Number: MCD-00053; Status: Released; Part_Type: Resistor; Package: R0402; ComponentLink1Description: Datasheet; ComponentLink1URL: http://tunmcdsvn.tun.st.com/Component_Datasheet_Library/Trunk/Resistors/Yageo_Resistor_RC0402-series
R3 = MCD-00059: Resistor,100K,0402,1%,1/16W; Manufacturer_Part_Number: RC0402FR-07100KL; Manufacturer: YAGEO; Alternate_Manufacturer_Part_Number: RT0402FRE07100KL; Provided_By: SUBCO; ECCN_US: EAR99; ECCN_EU: NEC; Internal_Part_Number: MCD-00059; Status: Released; Part_Type: Resistor; Alternate_Manufacturer: YAGEO; Package: R0402; ComponentLink1Description: Datasheet; ComponentLink1URL: http://tunmcdsvn.tun.st.com/Component_Datasheet_Library/Trunk/Resistors/Yageo_Resistor_RC0402-series
R6 R14 = MCD-00119: Resistor,100R,0402,1%,1/16W; Manufacturer_Part_Number: RC0402FR-07100RL; Manufacturer: YAGEO; Provided_By: SUBCO; ECCN_US: EAR99; ECCN_EU: NEC; Internal_Part_Number: MCD-00119; Status: Released; Part_Type: Resistor; ComponentLink1Description: Datasheet; Package: R0402; ComponentLink1URL: http://tunmcdsvn.tun.st.com/Component_Datasheet_Library/Trunk/Resistors/Yageo_Resistor_RC0402-series
R7 R8 R10 = MCD-00065: Resistor,4K7,0402,1%,1/16W; Manufacturer_Part_Number: RC0402FR-074K7L; Manufacturer: YAGEO; Alternate_Manufacturer_Part_Number: RT0402FRE074K7L; Provided_By: SUBCO; ECCN_US: EAR99; ECCN_EU: NEC; Internal_Part_Number: MCD-00065; Status: Released; ComponentLink1Description: Datasheet; Alternate_Manufacturer: YAGEO; Part_Type: Resistor; Package: R0402; ComponentLink1URL: http://tunmcdsvn.tun.st.com/Component_Datasheet_Library/Trunk/Resistors/Yageo_Resistor_RC0402-series
R9 = MCD-00055: Resistor,2K7,0402,1%,1/16W; Manufacturer_Part_Number: RC0402FR-072K7L; Manufacturer: YAGEO; Provided_By: SUBCO; ECCN_US: EAR99; ECCN_EU: NEC; Internal_Part_Number: MCD-00055; Status: Released; ComponentLink1Description: Datasheet; Part_Type: Resistor; Package: R0402; ComponentLink1URL: http://tunmcdsvn.tun.st.com/Component_Datasheet_Library/Trunk/Resistors/Yageo_Resistor_RC0402-series
R11-R13 R15-R17 = MCD-00481: Resistor,47R,0402,1%,1/16W; Manufacturer_Part_Number: RC0402FR-0747RL; Manufacturer: YAGEO; Provided_By: SUBCO; ECCN_US: EAR99; ECCN_EU: NEC; Internal_Part_Number: MCD-00481; Status: Released; Part_Type: Resistor; Package: R0402; ComponentLink1Description: Datasheet; ComponentLink1URL: http://tunmcdsvn.tun.st.com/Component_Datasheet_Library/Trunk/Resistors/Yageo_Resistor_RC0402-series
R18 = MCD-00185: Resistor,3K,0402,1%,1/16W; Manufacturer_Part_Number: RC0402FR-073KL; Manufacturer: YAGEO; Provided_By: SUBCO; ECCN_US: EAR99; ECCN_EU: NEC; Internal_Part_Number: MCD-00185; Status: Released; ComponentLink1Description: Datasheet; Part_Type: Resistor; Package: R0402; ComponentLink1URL: http://tunmcdsvn.tun.st.com/Component_Datasheet_Library/Trunk/Resistors/Yageo_Resistor_RC0402-series
R19 R20 = MCD-00197: Resistor,330R,0603,1%,1/10W; Manufacturer_Part_Number: RC0603FR-07330RL; Manufacturer: YAGEO; BMS_Part_Number: 9129729; Provided_By: SUBCO; ECCN_US: EAR99; ECCN_EU: NEC; Internal_Part_Number: MCD-00197; Status: Released; ComponentLink1Description: Datasheet; Part_Type: Resistor; Package: R0603; ComponentLink1URL: http://tunmcdsvn.tun.st.com/Component_Datasheet_Library/Trunk/Resistors/Yageo_Resistor_RC0603-series
R25 = MCD-00070: Resistor,1K,0603,1%,1/10W; Manufacturer_Part_Number: RC0603FR-071KL; Manufacturer: YAGEO; Provided_By: SUBCO; ECCN_US: EAR99; ECCN_EU: NEC; Internal_Part_Number: MCD-00070; ComponentLink1Description: Datasheet; Status: Released; Part_Type: Resistor; Package: R0603; ComponentLink1URL: http://tunmcdsvn.tun.st.com/Component_Datasheet_Library/Trunk/Resistors/Yageo_Resistor_RC0603-series
U5 = MCD-00159: 500mA, Enhanced single channel power switches with active high enable pin; Part_Type: IC; Manufacturer: STMICROELECTRONICS; Alternate_Manufacturer_Part_Number: TPS2051C; Alternate_Manufacturer: TEXAS INSTRUMENTS; BMS_Part_Number: 9159009; Provided_By: SUBCO with ST control; ECCN_US: EAR99; ECCN_EU: NEC; Internal_Part_Number: MCD-00159; Status: Released; Manufacturer_Part_Number: STMPS2151STR; ComponentLink1Description: Datasheet; ComponentLink1URL: http://tunmcdsvn.tun.st.com/Component_Datasheet_Library/Trunk/IC/STM_PWR-Switch_STMPS2151STR
U9 = MCD-00596: STM32F723IEK  (STM32F7) BGA176; Part_Type: IC; Manufacturer_Part_Number: STM32F723IEK6; Manufacturer: STMICROELECTRONICS; BMS_Part_Number: 9175300; Provided_By: SUBCO with ST control; ECCN_US: 3A991A2; ECCN_EU: NEC; Internal_Part_Number: MCD-00596; Status: Released; ComponentLink1Description: Datasheet; ComponentLink1URL: http://tunmcdsvn.tun.st.com/Component_Datasheet_Library/Trunk/IC/BGA176+25L_10x10x0.6_pitch0.65
U10 = MCD-00170: as U11 on sheet STM32_microcontroller_IOs; Internal_Part_Number: MCD-00170; Status: Released; Manufacturer_Part_Number: ESDALC6V1-1U2; ComponentLink1Description: Datasheet; ComponentLink1URL: http://tunmcdsvn.tun.st.com/Component_Datasheet_Library/Trunk/Diodes/STM_ESD_ESDALC6V1-1U2
U15 U16 = MCD-00136: Dual Transil array for ESD protection; Part_Type: Diode; Manufacturer: STMICROELECTRONICS; BMS_Part_Number: 9151112; Provided_By: SUBCO with ST control; ECCN_US: EAR99; ECCN_EU: NEC; Internal_Part_Number: MCD-00136; Status: Released; Manufacturer_Part_Number: ESDALC6V1W5; ComponentLink1Description: Datasheet; ComponentLink1URL: http://tunmcdsvn.tun.st.com/Component_Datasheet_Library/Trunk/Diodes/STM_ESD_ESDALC6V1W5
U17 = MCD-00649: Common mode filter with ESD protection for USB 2.0 interface; Part_Type: Diode; Manufacturer: STMICROELECTRONICS; BMS_Part_Number: 9151138; Provided_By: SUBCO with ST control; ECCN_US: EAR99; ECCN_EU: NEC; Internal_Part_Number: MCD-00649; Status: Released; Manufacturer_Part_Number: ECMF02-2AMX6; ComponentLink1Description: Datasheet; ComponentLink1URL: http://tunmcdsvn.tun.st.com/Component_Datasheet_Library/Trunk/Diodes/STM_ESD_ECMF02-2AMX6
U18 = MCD-00251: High power transient voltage suppressor, 7V breakdown; Part_Type: Diode; Manufacturer: STMICROELECTRONICS; BMS_Part_Number: 9179042; Provided_By: SUBCO with ST control; ECCN_US: EAR99; ECCN_EU: NEC; Internal_Part_Number: MCD-00251; Status: Released; Manufacturer_Part_Number: ESDA7P60-1U1M; ComponentLink1Description: Datasheet; ComponentLink1URL: http://tunmcdsvn.tun.st.com/Component_Datasheet_Library/Trunk/Diodes/STM_ESD_ESDA7P60-1U1M
X1 = MCD-00597: Oscillator 25Mhz, +-50ppm, Vcc:3.3V typ, square wave: [0.1Vcc;0.9Vcc], Enable pin, SMD; Manufacturer_Part_Number: NZ2520SH 25MHz END4869C; Manufacturer: NDK; Alternate_Manufacturer_Part_Number: NZ2520SB 25MHz END4869B; Part_Type: Crystal_Osc; BMS_Part_Number: 9157050; Provided_By: SUBCO; ECCN_US: EAR99; ECCN_EU: NEC; Internal_Part_Number: MCD-00597; Status: Released; Alternate_Manufacturer: NDK; ComponentLink1Description: Datasheet; ComponentLink1URL: http://tunmcdsvn.tun.st.com/Component_Datasheet_Library/Trunk/Crystal_Osc/NDK_NZ2520SH 25MHz END4869C